# EAGLE design MC-10 Mod A_V_revA (EAGLE 7.2.0)
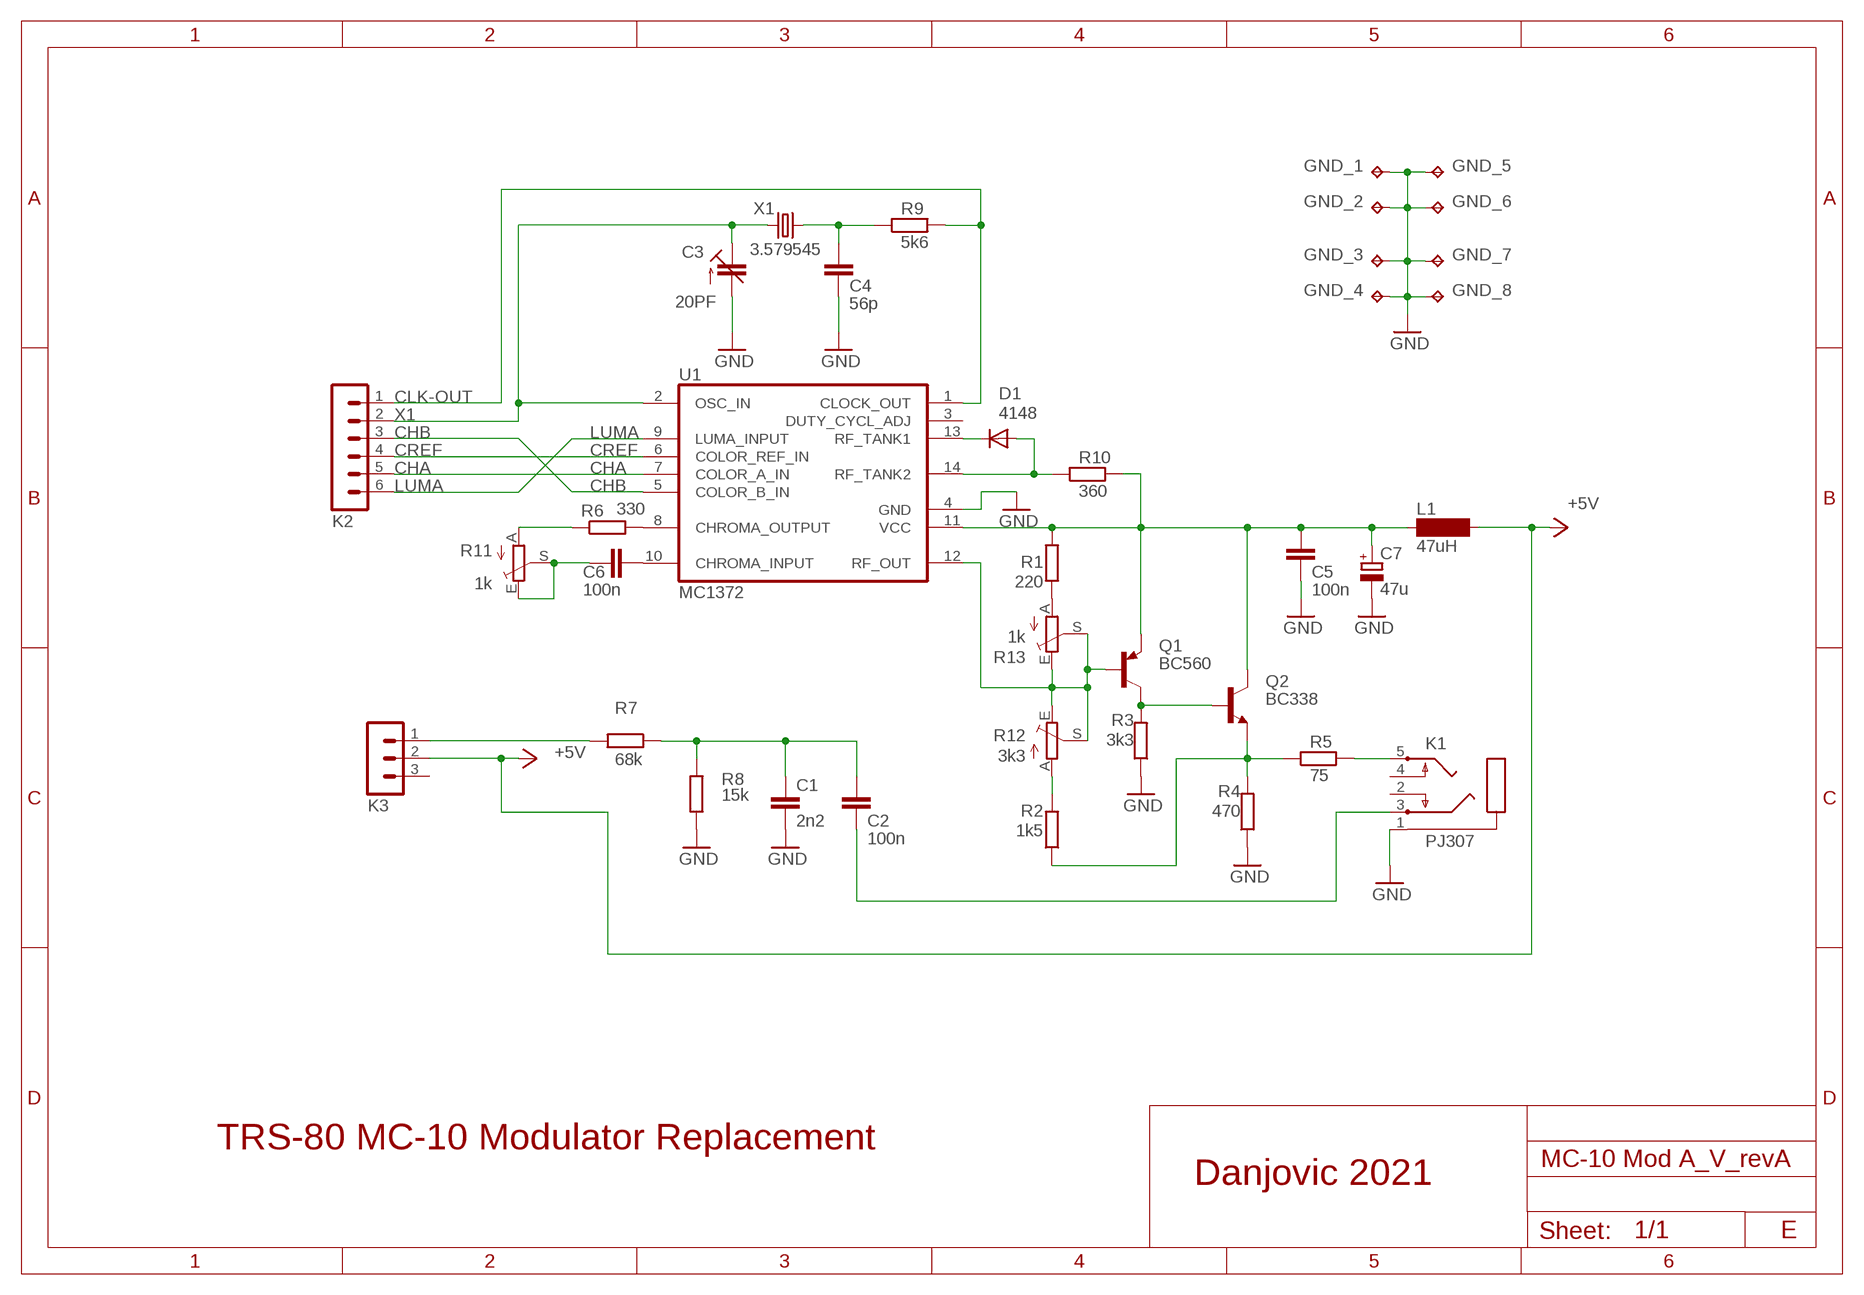
[diagram p0: schematic, sheet 1]

## Parts
C1  2n2  C-EU050-024X044  [C050-024X044]
C2  100n  C-EU050-024X044  [C050-024X044]
C3  20PF  C-TRIMM3050.504  [CTRIM3050.504]
C4  56p  C-EU025-024X044  [C025-024X044]
C5  100n  C-EU050-024X044  [C050-024X044]
C6  100n  C-EU050-024X044  [C050-024X044]
C7  47u  CPOL-EUE2.5-5  [E2,5-5]
D1  4148  DIODE-D-5  [D-5]
GND_1  TPPAD1-13  [P1-13]
GND_2  TPPAD1-13  [P1-13]
GND_3  TPPAD1-13  [P1-13]
GND_4  TPPAD1-13  [P1-13]
GND_5  TPPAD1-13  [P1-13]
GND_6  TPPAD1-13  [P1-13]
GND_7  TPPAD1-13  [P1-13]
GND_8  TPPAD1-13  [P1-13]
K1  PJ307  [PJ307]
K2  MA06-1  [MA06-1]
K3  MA03-1  [MA03-1]
L1  47uH  BS75  [BS75]
Q1  BC560  BC327  [TO92-EBC]
Q2  BC338  [TO92-EBC]
R1  220  R-EU_0204/7  [0204/7]
R2  1k5  R-EU_0204/7  [0204/7]
R3  3k3  R-EU_0204/7  [0204/7]
R4  470  R-EU_0204/7  [0204/7]
R5  75  R-EU_0204/7  [0204/7]
R6  330  R-EU_0204/7  [0204/7]
R7  68k  R-EU_0204/7  [0204/7]
R8  15k  R-EU_0204/7  [0204/7]
R9  5k6  R-EU_0204/7  [0204/7]
R10  360  R-EU_0204/7  [0204/7]
R11  1k  TRIM_EU-RS3  [RS3]
R12  3k3  TRIM_EU-RS3  [RS3]
R13  1k  TRIM_EU-RS3  [RS3]
U1  MC1372  [DIL14]
X1  3.579545  CRYSTALHC49U70  [HC49U70]

## Nets
+5V: K3.2 L1.2
AUD-OUT: C2.2 K1.3
CHA: K2.5 U1.7(COLOR_A_IN)
CHB: K2.3 U1.5(COLOR_B_IN)
CLK-OUT: K2.1 R9.2 U1.1(CLOCK_OUT)
CREF: K2.4 U1.6(COLOR_REF_IN)
GND: C1.2 C3.2(A) C4.2 C5.2 C7.- GND_1.TP GND_2.TP GND_3.TP GND_4.TP GND_5.TP GND_6.TP GND_7.TP GND_8.TP K1.1 R3.1 R4.1 R8.1 U1.4(GND)
LUMA: K2.6 U1.9(LUMA_INPUT)
N$1: R6.2 U1.8(CHROMA_OUTPUT)
N$3: C1.1 C2.1 R7.1 R8.2
N$4: D1.C U1.13(RF_TANK1)
N$6: R6.1 R11.A
N$7: Q1.B R12.E R12.S R13.E R13.S U1.12(RF_OUT)
N$8: C6.2 U1.10(CHROMA_INPUT)
N$9: C4.1 R9.1 X1.2
N$10: R1.1 R13.A
N$11: C6.1 R11.E R11.S
N$12: Q1.C Q2.B R3.2
N$13: Q2.E R2.1 R4.2 R5.1
N$14: R2.2 R12.A
N$19: D1.A R10.1 U1.14(RF_TANK2)
SOUND: K3.1 R7.2
VCC: C5.1 C7.+ L1.1 Q1.E Q2.C R1.2 R10.2 U1.11(VCC)
VID-OUT: K1.5 R5.2
X1: C3.1(E) K2.2 U1.2(OSC_IN) X1.1
Unconnected: K1.2 K1.4 K3.3 U1.3(DUTY_CYCL_ADJ)

## Notes on the sheet
- TRS-80 MC-10 Modulator Replacement
- Danjovic 2021
- E

## Library data of the parts
C1 C2 C4-C6 = rcl:C-EU: CAPACITOR, European symbol
C3 = rcl:C-TRIMM: Trimm capacitor
C7 = rcl:CPOL-EU: POLARIZED CAPACITOR, European symbol
D1 = diode:DIODE-: DIODE
GND_1-GND_8 = testpad:TP: Test pad
K1 = AudioJack:PJ307: MIC/HEADPHONE JACK KS-S stereo microphone/headphone jack PJ307; OC_FARNELL: unknown; OC_NEWARK: unknown
K2 = con-lstb:MA06-1: PIN HEADER; OC_FARNELL: unknown; OC_NEWARK: unknown
K3 = con-lstb:MA03-1: PIN HEADER; OC_FARNELL: unknown; OC_NEWARK: unknown
L1 = inductor-neosid:BS: INDUCTOR nominal inductance, magnetically screened; OC_FARNELL: unknown; OC_NEWARK: unknown
Q1 = transistor-pnp:BC327*: PNP Transistror
Q2 = transistor-npn:BC338*: NPN Transistor
R1-R10 = rcl:R-EU_: RESISTOR, European symbol
R11-R13 = pot:TRIM_EU-: POTENTIOMETER
U1 = MC-10:MC1372: Color TV Video Modulator
X1 = crystal:CRYSTAL: CRYSTAL; OC_FARNELL: unknown; OC_NEWARK: unknown

## Board
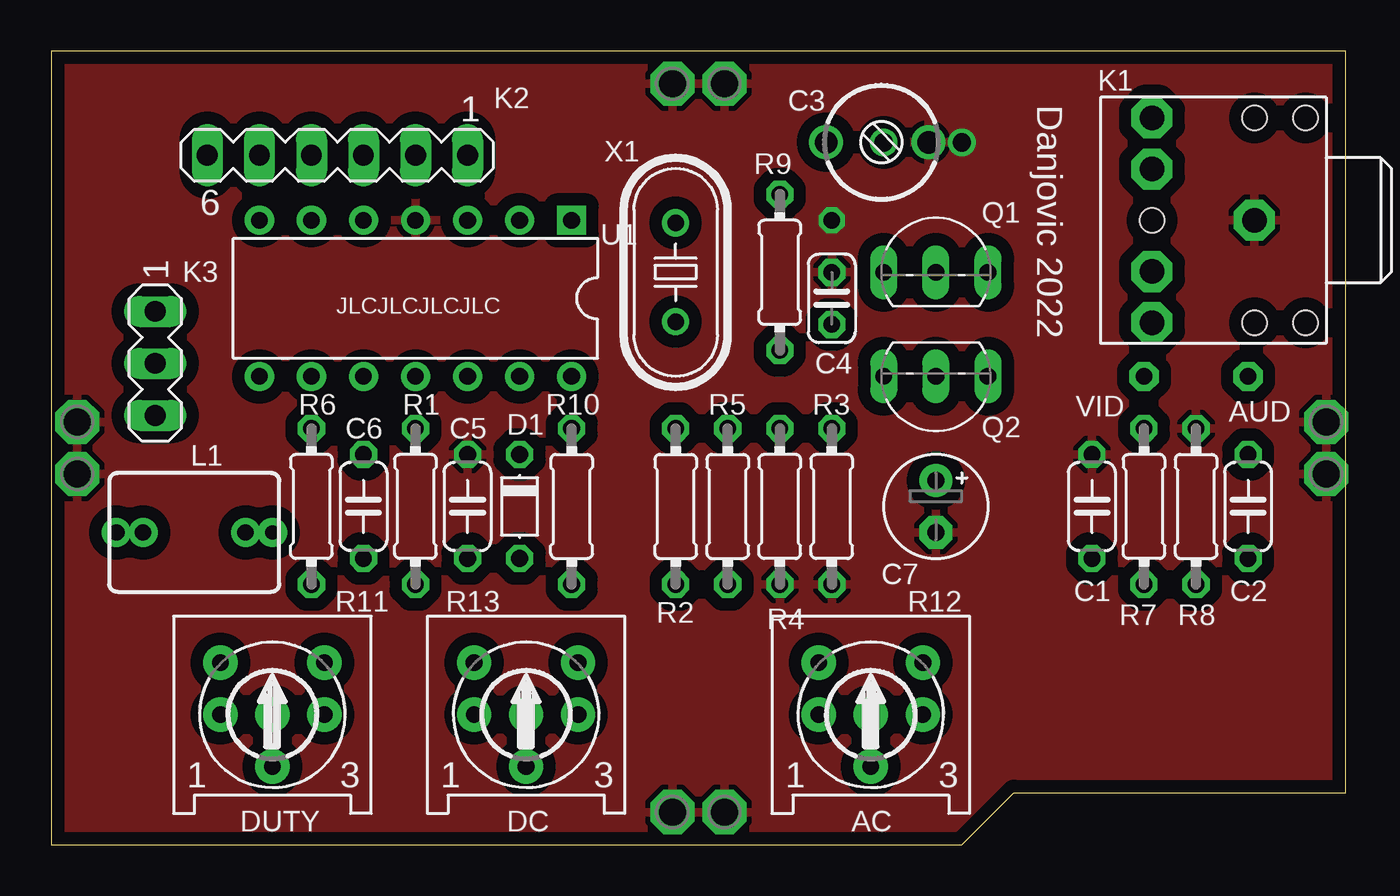
[diagram p1: board, top side]
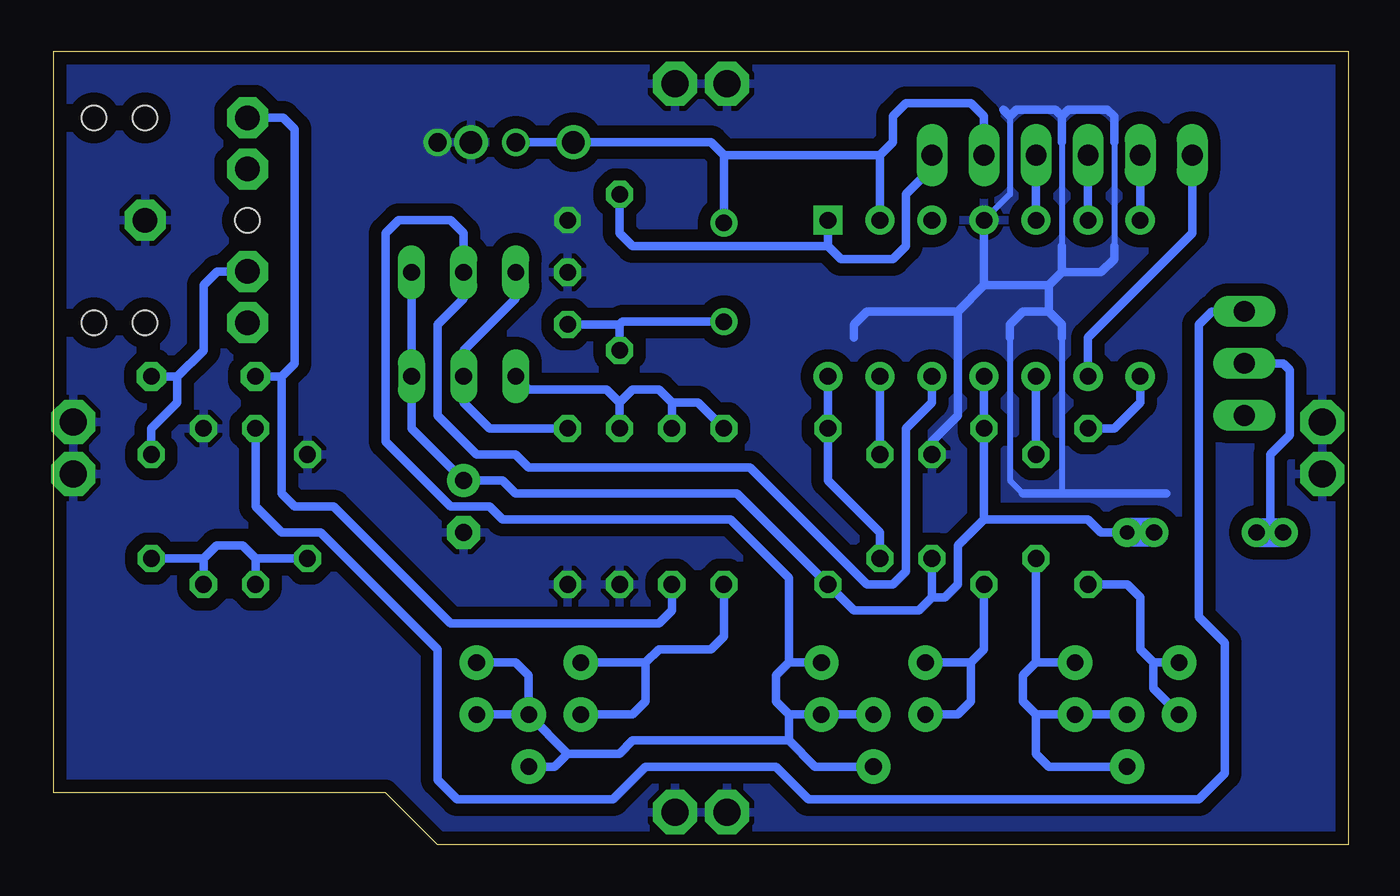
[diagram p2: board, bottom side, seen from below]

Size 63.18 x 38.73 mm. Coordinates in mm from the lower left corner, seen from the top.
Outline: 0,38.73 0,0 44.45,0 46.99,2.54 63.18,2.54 63.18,38.73 0,38.73
Copper layers (1*16): Top 0.035mm / dielectric 1.5mm / Bottom 0.035mm
Design rules "default *": minimum track width 10mil, minimum drill 24mil, track to track 8mil, track to pad 8mil, pad to pad 8mil, via to via 8mil, smd to smd 8mil, copper to edge 25mil, drill to drill 8mil, minimum pad ring 10mil, minimum via ring 8mil, stop-mask expansion 4mil, vias tented up to drill 0mil, thermal gap 10mil

### Footprints (pad centres in the part's own frame; a part is rotated, then mirrored left to right if it is on the bottom)
C050-024X044 = drill 0.813 octagon: 1 -2.54,0; 2 2.54,0
CTRIM3050.504 = drill 1.1: 1 -2.5,0; 2 2.5,0
C025-024X044 = drill 0.813 octagon: 1 -1.27,0; 2 1.27,0
E2,5-5 = drill 0.813 pad 1.6: + -1.27,0 | drill 0.813 pad 1.6 octagon: - 1.27,0
D-5 = drill 0.813 octagon: A 2.54,0; C -2.54,0
P1-13 = drill 1.321 pad 2.159 octagon: TP 0,0
PJ307 = drill 1.2 pad 2 octagon: 1 0,-3.5; 2 5,-8.5; 3 2.5,-8.5; 4 -2.5,-8.5; 5 -5,-8.5 | hole 1.2: 5,-3.5; 5,-1; -5,-1; -5,-3.5; 0,-8.5
MA06-1 = drill 1.016 long: 1 -6.35,0; 2 -3.81,0; 3 -1.27,0; 4 1.27,0; 5 3.81,0; 6 6.35,0
MA03-1 = drill 1.016 long: 1 -2.54,0; 2 0,0; 3 2.54,0
BS75 = drill 0.8 pad 1.422: 1 -2.5,0; 2 2.5,0
TO92-EBC = drill 0.813 long: B 0,-1.27; C -2.54,-1.27; E 2.54,-1.27
0204/7 = drill 0.813 octagon: 1 -3.81,0; 2 3.81,0
RS3 = drill 0.813 pad 1.676: A -2.54,2.54; E 2.54,2.54; S 0,-2.54
DIL14 = drill 0.813 pad 1.422 square: 1 -7.62,-3.81 | drill 0.813 pad 1.422: 2 -5.08,-3.81; 3 -2.54,-3.81; 4 0,-3.81; 5 2.54,-3.81; 6 5.08,-3.81; 7 7.62,-3.81; 8 7.62,3.81; 9 5.08,3.81; 10 2.54,3.81; 11 0,3.81; 12 -2.54,3.81; 13 -5.08,3.81; 14 -7.62,3.81
HC49U70 = drill 0.813: 1 -2.413,0; 2 2.413,0

### Placement (x,y rotation side)
C1  50.8,16.51 90 top
C2  58.42,16.51 90 top
C3  40.32,34.29 0 top
C4  38.1,26.67 90 top
C5  20.32,16.51 90 top
C6  15.24,16.51 90 top
C7  43.18,16.51 270 top
D1  22.86,16.51 270 top
GND_1  62.23,20.64 0 top
GND_2  62.23,18.1 0 top
GND_3  1.27,20.64 0 top
GND_4  1.27,18.1 0 top
GND_5  30.32,37.15 90 top
GND_6  32.86,37.15 90 top
GND_7  30.32,1.59 90 top
GND_8  32.86,1.59 90 top
K1  62.23,30.48 270 top
K2  13.97,33.66 180 top
K3  5.08,23.49 270 top
L1  6.98,15.24 180 top
Q1  43.18,29.21 0 top
Q2  43.18,21.59 180 top
R1  17.78,16.51 90 top
R2  30.48,16.51 270 top
R3  38.1,16.51 90 top
R4  35.56,16.51 90 top
R5  33.02,16.51 270 top
R6  12.7,16.51 90 top
R7  53.34,16.51 90 top
R8  55.88,16.51 270 top
R9  35.56,27.94 90 top
R10  25.4,16.51 270 top
R11  10.79,6.35 0 top
R12  40.01,6.35 0 top
R13  23.18,6.35 0 top
U1  17.78,26.67 180 top
X1  30.48,27.94 270 top

### Tracks (layer width: path | path; a pad name or v marks a point on that pad's centre or on a via)
+5V  (via drill 0.8 pad 1.42)
  Bottom 0.406: K3.2 3.18,23.49 2.86,23.18 2.86,20 3.81,19.05 3.81,15.24 | 2.86,15.56 v3.18,15.24
  Bottom 1.422: L1.2 3.81,15.24 v3.18,15.24
AUD-OUT  (via drill 0.8 pad 1.42)
  Bottom 0.406: C2.2 58.42,20.32 57.15,21.59 57.15,22.86 | v58.42,22.86 57.15,22.86 | K1.3 55.2,27.98 55.88,27.3 55.88,24.13 57.15,22.86
CHA
  Bottom 0.406: K2.5 U1.7
CHB
  Bottom 0.406: K2.3 U1.5
CLK-OUT
  Bottom 0.406: K2.1 20.32,33.02 21.59,31.75 21.59,29.21 22.23,28.58 24.77,28.58 25.4,29.21 | U1.1 25.4,29.21 | 25.4,29.21 34.93,29.21 35.56,29.84 R9.2
CREF
  Bottom 0.406: K2.4 U1.6
GND  (via drill 0.8 pad 1.27, 0.9)
  Bottom 0.305: 16.51,35.56 16.51,31.75 U1.4 | 16.51,24.77 16.51,17.78 15.87,17.15 | 13.97,24.77 13.97,17.15 | 13.97,34.29 13.97,29.21 | 11.43,34.29 11.43,29.21
  Bottom 0.406: U1.4 17.78,27.3 | 17.78,27.3 19.05,26.03 | 19.05,26.03 19.05,20.95 20.32,19.69 C5.2 | 13.97,35.56 13.65,35.88 11.75,35.88 11.43,35.56 11.43,34.29 | 13.97,34.29 13.97,35.56 | 13.97,35.56 14.29,35.88 16.19,35.88 16.51,35.56 16.83,35.88 | 11.43,29.21 11.43,28.58 12.06,27.94 13.97,27.94 | 13.97,27.94 13.97,29.21 | 13.97,27.94 14.6,27.3 | 14.6,27.3 14.6,26.03 | 14.6,26.03 13.97,25.4 13.97,24.77 | 14.6,27.3 17.78,27.3 | 16.51,24.77 16.51,25.4 15.87,26.03 14.6,26.03 | 24.13,24.77 24.13,25.4 23.49,26.03 19.05,26.03 | 15.87,17.15 13.97,17.15 8.89,17.15
  other vias: 44.45,34.29 38.1,30.48
  pour Bottom (isolate 0.61): 0,38.73 0,0 63.18,0 63.18,38.73
  pour Top (isolate 0.61): 0,38.73 0,0 63.18,0 63.18,38.73
LUMA
  Bottom 0.406: K2.6 7.62,29.84 12.7,24.77 U1.9
N$1
  Bottom 0.406: R6.2 11.43,20.32 10.16,21.59 U1.8
N$3
  Bottom 0.406: C1.1 53.34,13.97 | 53.34,13.97 53.98,14.6 55.25,14.6 55.88,13.97 | 55.88,13.97 C2.1 | R8.2 55.88,13.97 | R7.1 53.34,13.97
N$4
  Bottom 0.406: U1.13 D1.C
N$6  (via drill 0.8 pad 1.68)
  Bottom 0.406: v8.26,6.35 9.53,7.62 9.53,8.89 | 9.53,8.89 R11.A | 9.53,8.89 10.16,9.53 10.16,12.06 10.79,12.7 R6.1
N$7  (via drill 0.8 pad 1.68)
  Bottom 0.406: U1.12 20.32,21.59 21.59,20.32 21.59,13.33 22.23,12.7 23.49,12.7 29.21,18.41 40.01,18.41 40.64,19.05 42.55,19.05 44.45,20.95 44.45,25.4 43.18,26.67 Q1.B 43.18,29.84 43.82,30.48 46.36,30.48 46.99,29.84 46.99,19.69 43.82,16.51 41.91,16.51 41.27,15.87 30.16,15.87 27.3,13.02 27.3,8.89 | v23.18,6.35 v25.72,6.35 27.3,6.35 | R13.E 27.3,8.89 | R13.S 26.03,3.81 27.3,5.08 | 27.3,8.89 27.94,8.26 27.94,6.98 27.3,6.35 | 27.3,5.08 27.3,6.35 | R12.E 40.64,8.89 40.01,8.26 v40.01,6.35 | v40.01,6.35 38.1,4.45 | 38.1,4.45 35.56,4.45 34.93,5.08 27.3,5.08 | R12.S 38.73,3.81 38.1,4.45 | v42.55,6.35 v40.01,6.35
N$8
  Bottom 0.406: U1.10 C6.2
N$9
  Bottom 0.406: C4.1 35.56,25.4 | R9.1 35.56,25.4 | X1.2 35.43,25.53 35.56,25.4
N$10  (via drill 0.8 pad 1.68)
  Bottom 0.406: R1.1 17.78,9.53 18.41,8.89 | v20.64,6.35 19.05,6.35 18.41,6.98 18.41,8.89 | R13.A 18.41,8.89
N$11  (via drill 0.8 pad 1.68)
  Bottom 0.406: C6.1 15.24,8.89 | 15.24,8.89 R11.E | 15.24,6.35 v13.33,6.35 v10.79,6.35 | R11.S 14.6,3.81 15.24,4.45 15.24,6.35 | 15.24,8.89 15.87,8.26 15.87,6.98 15.24,6.35
N$12
  Bottom 0.406: Q1.C 40.64,26.67 43.18,24.13 Q2.B 43.18,21.59 41.91,20.32 R3.2
N$13
  Bottom 0.406: R2.1 31.75,21.59 33.02,21.59 | 33.02,21.59 33.66,22.23 34.93,22.23 35.56,21.59 | 35.56,21.59 36.2,22.23 40.01,22.23 Q2.E | 33.02,21.59 R5.1 | 35.56,21.59 R4.2
N$14  (via drill 0.8 pad 1.68)
  Bottom 0.406: R2.2 30.48,10.16 31.12,9.53 33.66,9.53 34.29,8.89 | 34.29,8.89 34.29,6.98 34.93,6.35 v37.47,6.35 | R12.A 34.29,8.89
N$19
  Bottom 0.406: U1.14 R10.1 25.4,17.78 22.86,15.24 D1.A
SOUND
  Bottom 0.406: 4.13,26.03 K3.1 6.67,26.03 7.3,25.4 7.3,11.11 6.03,9.84 6.03,3.49 7.3,2.22 26.35,2.22 27.94,3.81 34.29,3.81 35.88,2.22 43.5,2.22 44.45,3.18 44.45,9.53 50.16,15.24 52.07,15.24 53.34,16.51 R7.2
VCC  (via drill 0.7 pad 1.42)
  Bottom 0.406: U1.11 R1.2 17.78,15.87 | Q1.E Q2.C 45.72,20.32 C7.+ 41.27,17.78 40.64,17.15 29.84,17.15 R10.2 24.13,11.43 20.95,11.43 20.32,12.06 | 20.32,12.06 C5.1 | 17.78,15.87 19.05,14.6 19.05,12.7 19.69,12.06 20.32,12.06 | 17.78,15.87 12.7,15.87 12.06,15.24 v10.79,15.24
  Bottom 1.422: L1.1 v10.79,15.24
VID-OUT  (via drill 0.8 pad 1.42)
  Bottom 0.406: 52.07,22.86 52.07,17.15 51.44,16.51 49.53,16.51 43.82,10.79 33.66,10.79 33.02,11.43 R5.2 | 52.07,22.86 v53.34,22.86 | K1.5 51.99,35.48 51.44,34.93 51.44,23.49 52.07,22.86
X1  (via drill 0.9)
  Bottom 0.406: K2.2 17.78,35.56 18.41,36.2 21.59,36.2 22.23,35.56 22.23,34.29 22.86,33.66 | 30.48,33.66 31.12,34.29 C3.1 v40.64,34.29 | 30.48,33.66 X1.1 | 22.86,33.66 30.48,33.66 | U1.2 22.86,33.66

### Text on the board
tPlace: Danjovic 2022 | JLCJLCJLCJLC | VID | AUD | DUTY | DC | AC
tStop: MC-10 | A/V MOD